# EasyEDA Pro project ProPrj_Pico_Pi_W_2024-12-25.epro

# Schematic PicoW
Board Name: PIcoBatt_R001; Create Date: 2024-12-15; Page Name: MAIN; Project Name: Pico_Pi_W; Schematic Name: PicoW; Update Date: 2024-12-24; Company: EasyEDA.com; Page Size: A4; Version: V1.0
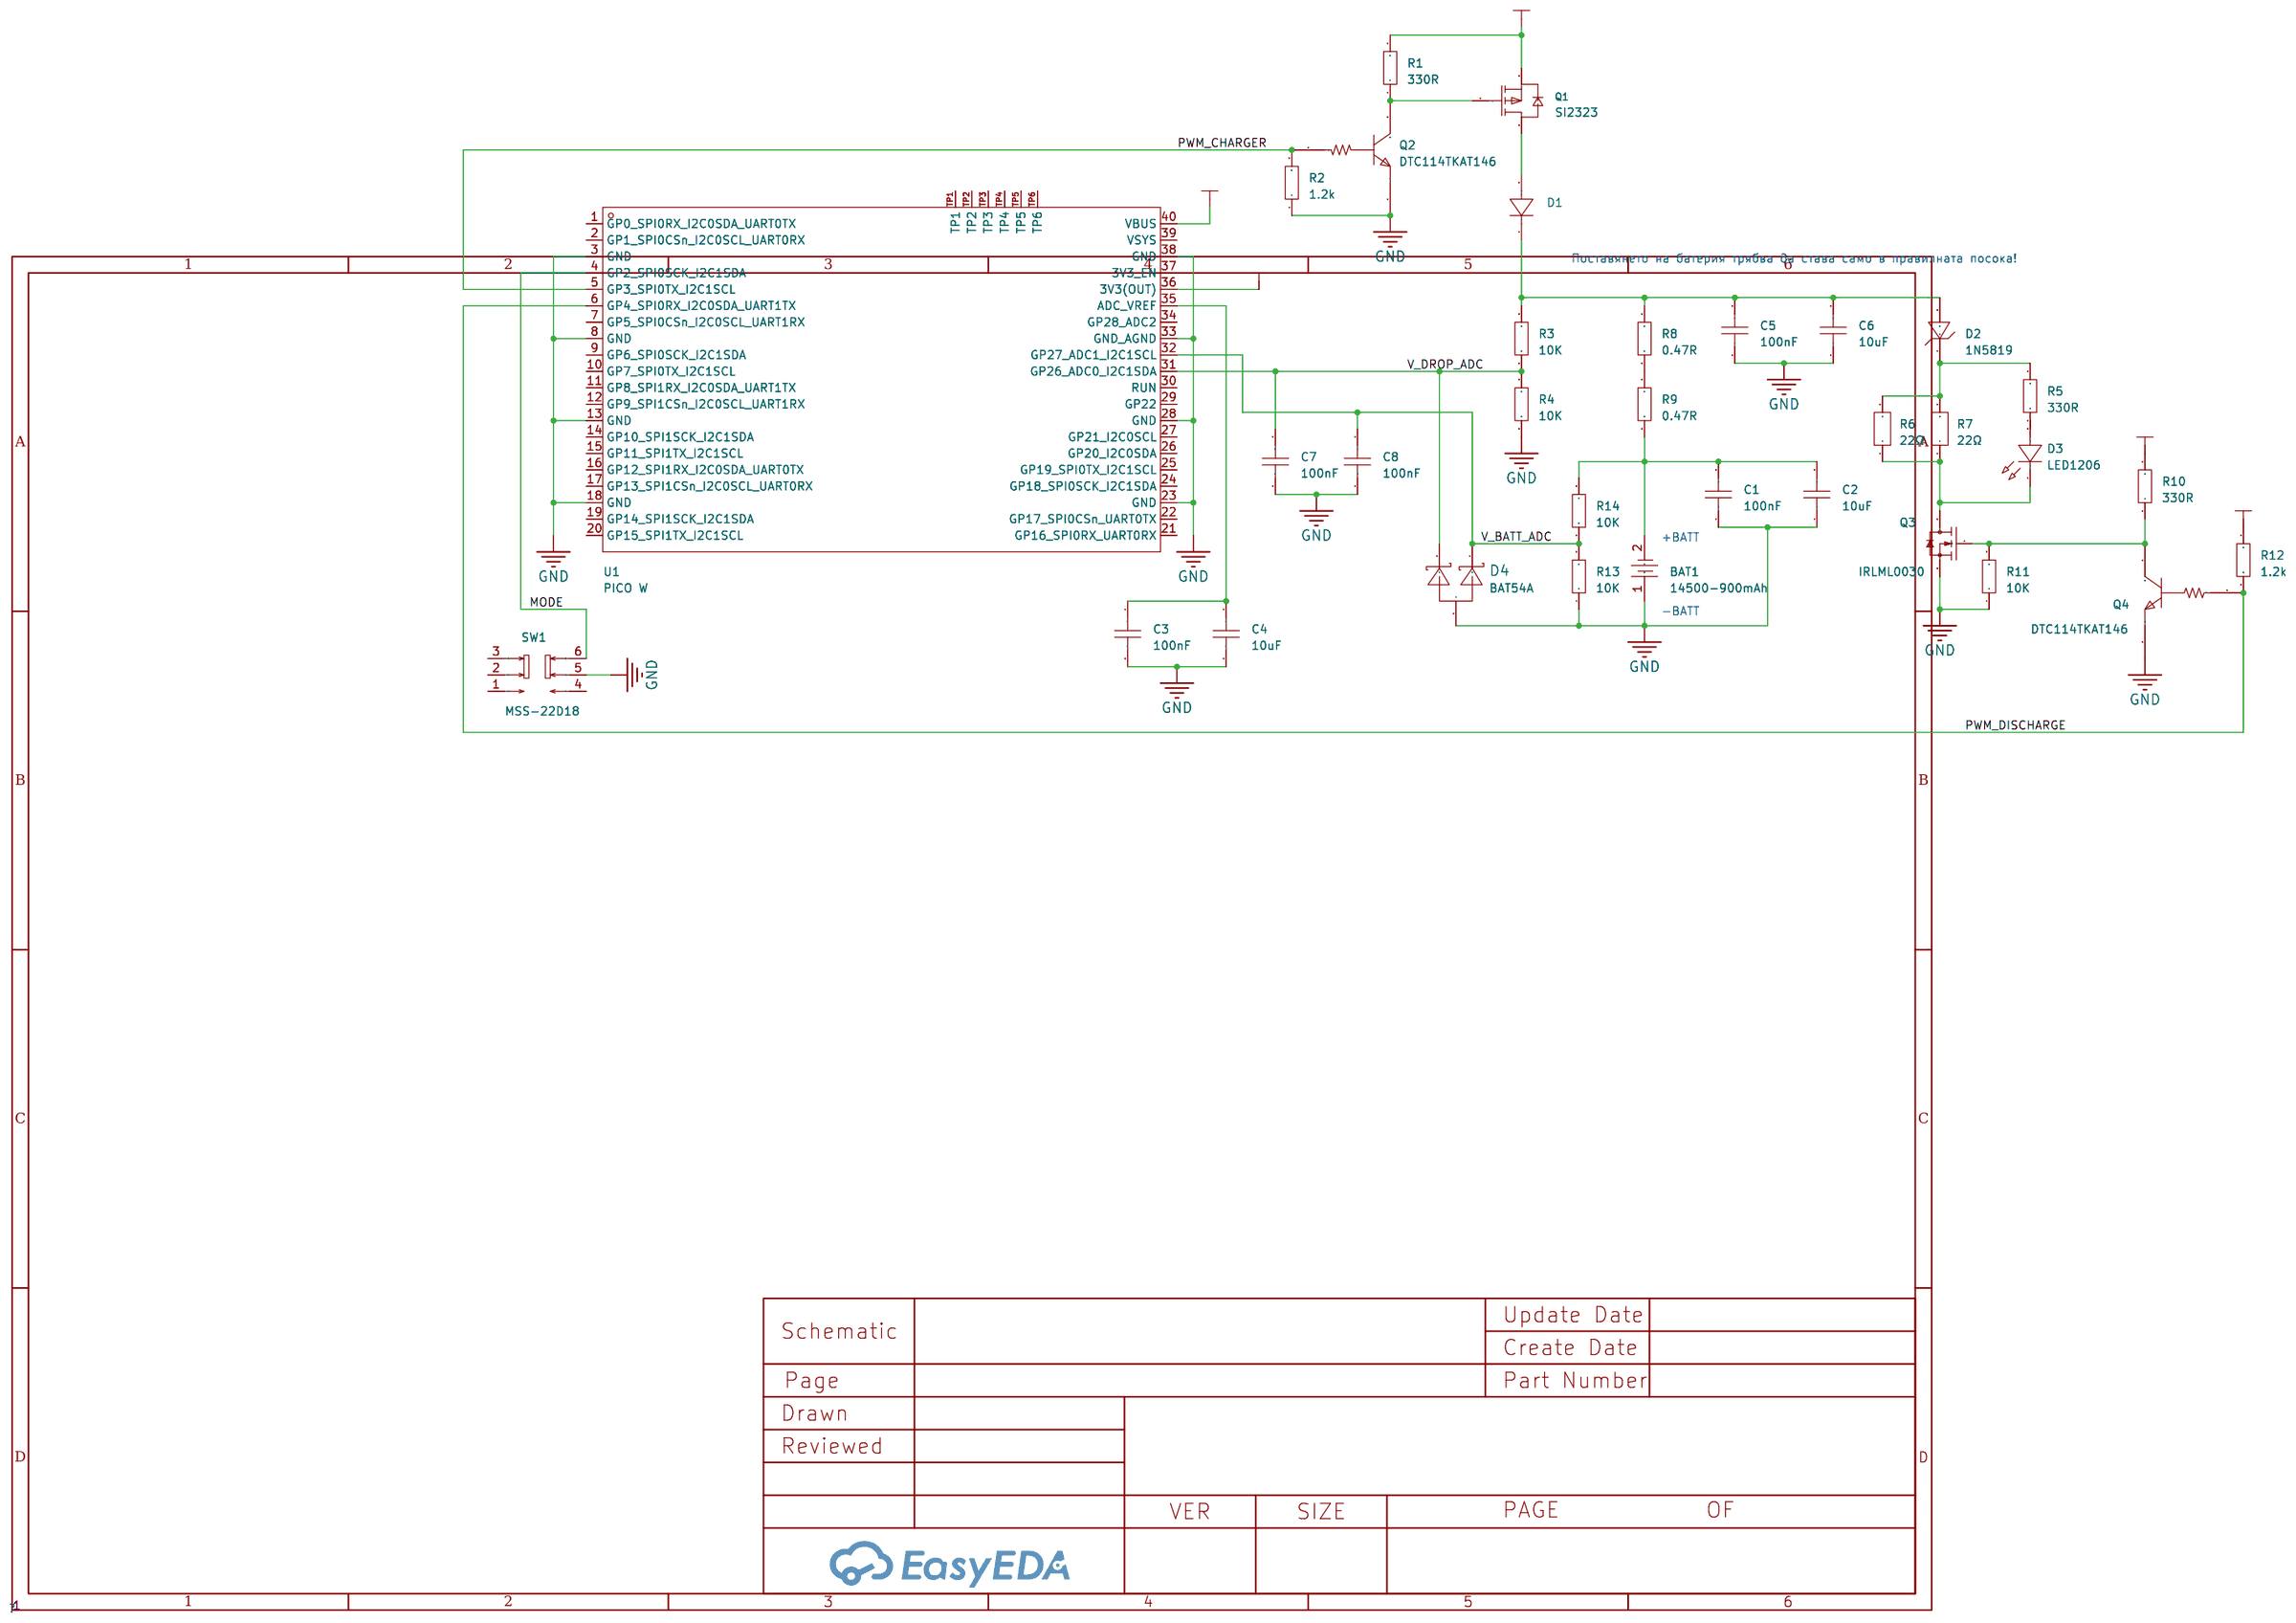
[diagram p0: schematic sheet]

## Parts
BAT1  14500-900mAh  [BAT-TH_FLY-ER14250-1200MAH-01]
C1  100nF  [C0805]
C2  10uF  [C0805]
C3  100nF  [C0805]
C4  10uF  [C0805]
C5  100nF  [C0805]
C6  10uF  [C0805]
C7  100nF  [C0805]
C8  100nF  [C0805]
D1  -  [SMA_L4.4-W2.8-LS5.4-RD]
D2  1N5819  [DO-41_BD2.4-L4.7-P8.70-D0.9-RD]
D3  LED1206  [LED1206-RD]
D4  BAT54A  [SOT-23-3_L2.9-W1.3-P1.90-LS2.4-BR]
Q1  SI2323  [SOT-23-3_L2.9-W1.3-P0.95-LS2.4-BR]
Q2  DTC114TKAT146  [SOT-346_L2.9-W1.6-P1.90-LS2.8-TR-CW]
Q3  IRLML0030  [SOT-23-3_L2.9-W1.3-P1.90-LS2.4-BR]
Q4  DTC114TKAT146  [SOT-346_L2.9-W1.6-P1.90-LS2.8-TR-CW]
R1  330R  [R0603]
R2  1.2k  [R0603]
R3  10K  [R0603]
R4  10K  [R0603]
R5  330R  [R0603]
R6  22Ω  [RES-TH_BD8.5-L24.5-P28.5-D0.7]
R7  22Ω  [RES-TH_BD8.5-L24.5-P28.5-D0.7]
R8  0.47R  [R0603]
R9  0.47R  [R0603]
R10  330R  [R0603]
R11  10K  [R0603]
R12  1.2k  [R0603]
R13  10K  [R0603]
R14  10K  [R0603]
SW1  MSS-22D18  [SW-TH_MSS-22D18]
U1  PICO W  [COMM-SMD_L51.0-W21.0-P2.54_PICOW]

## Library data of the parts
BAT1 = FLY-ER14250-1200mAh-01: LCSC Part Name: FLYOUNG(远阳) 锂亚电池 3.6V 1200mAh 1个; Supplier Part: C5452119; Manufacturer: FLYOUNG(远阳); Datasheet: https://atta.szlcsc.com/upload/public/pdf/source/20230427/35F5717F1146E75F362941FF46E4B7A2.pdf; Supplier: LCSC
C1-C8 = CAP_0805: Supplier Footprint: 0805
D1 = 1N4007: Supplier Footprint: SMA(DO-214AC); Supplier Part: C727081
D2 = 1N5819_C393567: Forward Voltage (Vf@If):600mV@1A Reverse Voltage (Vr):40V Average Rectified Current (Io):1A; LCSC Part Name: 电压:40V 电流:1A; Supplier Part: C393567; Manufacturer: 银河微电子; Supplier Footprint: DO-41; JLCPCB Part Class: Extended Part; Datasheet: https://atta.szlcsc.com/upload/public/pdf/source/20190516/C393567_30CB360D1A9B1F2C106DA119C236D680.pdf; Supplier: LCSC; Forward Voltage (Vf@If): 600mV@1A; Reverse Voltage (Vr): 40V; Average Rectified Current (Io): 1A
D3 = LED1206: Supplier Part: C9900027223; Supplier: LCSC
D4 = BAT54A: Forward Voltage (Vf@If):800mV@100mA Reverse Voltage (Vr):30V Average Rectified Current (Io):200mA; LCSC Part Name: 电压:30V 电流:200mA; Supplier Part: C179724; Manufacturer: HT(金誉); Supplier Footprint: SOT-23; Datasheet: https://atta.szlcsc.com/upload/public/pdf/source/20180207/C179724_15179896975631356395.pdf; Supplier: LCSC; Forward Voltage (Vf@If): 800mV@100mA; Reverse Voltage (Vr): 30V; Average Rectified Current (Io): 200mA
Q1 = SI2323: Type:1 Piece P-Channel Drain Source Voltage (Vdss):20V Continuous Drain Current (Id): Drain Source On Resistance (RDS(on)@Vgs,Id):50mΩ@2.5V Power Dissipation (Pd): Gate Threshold Voltage (Vgs(th)@Id):600mV@250uA Total Gate Charge (Qg@Vgs):8.5nC Input Capa; LCSC Part Name: P沟道,电流:5.3A,耐压:20V; Supplier Part: C5278892; Manufacturer: PAKER(派克微); Supplier Footprint: SOT-23; JLCPCB Part Class: Extended Part; Datasheet: https://atta.szlcsc.com/upload/public/pdf/source/20240104/3F2180898E74DA13754BF2A6B06D0427.pdf; Supplier: LCSC; Type: 1 Piece P-Channel; Drain Source Voltage (Vdss): 20V; Drain Source On Resistance (RDS(on)@Vgs,Id): 50mΩ@2.5V; Gate Threshold Voltage (Vgs(th)@Id): 600mV@250uA; Total Gate Charge (Qg@Vgs): 8.5nC; Input Capacitance (Ciss@Vds): 830pF; Reverse Transfer Capacitance (Crss@Vds): 85pF; Operating Temperature: -55℃~+150℃
Q2 Q4 = DTC114TKAT146: Transistor Type:- Collector-Emitter Breakdown Voltage (Vceo):50V Collector Current (Ic):100mA Power Dissipation (Pd):200mW DC Current Gain (hFE@Ic,Vce):100@1mA,5V Input Resistor:10kΩ Operating Temperature:-55℃~+150℃ Operating Temperature:-55℃~+150℃; LCSC Part Name: 耐压:50V 电流:100mA; Supplier Part: C111720; Manufacturer: ROHM(罗姆); Supplier Footprint: TO-236-3(SOT-23-3); JLCPCB Part Class: Extended Part; Datasheet: https://atta.szlcsc.com/upload/public/pdf/source/20170726/C111720_1501054455780843917.pdf; Supplier: LCSC; Collector-Emitter Breakdown Voltage (Vceo): 50V; Collector Current (Ic): 100mA; Power Dissipation (Pd): 200mW; DC Current Gain (hFE@Ic,Vce): 100@1mA,5V; Input Resistor: 10kΩ; Operating Temperature: -55℃~+150℃
Q3 = IRLML0030: Drain Source Voltage (Vdss): Continuous Drain Current (Id): Drain Source On Resistance (RDS(on)@Vgs,Id):38mΩ@10V Power Dissipation (Pd): Gate Threshold Voltage (Vgs(th)@Id):1.5V@250uA Total Gate Charge (Qg@Vgs):3nC@10V Input Capacitance (Ciss@Vds):233pF@1; LCSC Part Name: N沟道增强型MOSFET,电流:4.2A,耐压:30V; Supplier Part: C3647050; Manufacturer: Leiditech(雷卯电子); Supplier Footprint: SOT-23; JLCPCB Part Class: Extended Part; Datasheet: https://atta.szlcsc.com/upload/public/pdf/source/20220704/5B0D23EAE294CB70633FB1104757A67C.pdf; Supplier: LCSC; Drain Source On Resistance (RDS(on)@Vgs,Id): 38mΩ@10V; Gate Threshold Voltage (Vgs(th)@Id): 1.5V@250uA; Total Gate Charge (Qg@Vgs): 3nC@10V; Input Capacitance (Ciss@Vds): 233pF@15V; Reverse Transfer Capacitance (Crss@Vds): 33pF@15V; Operating Temperature: -55℃~+150℃
R1-R5 R8-R14 = Res_0603: Supplier Footprint: 0603
R6 R7 = FKN500JR-91-15R: Type:Wirewound Resistors Resistance: Tolerance:±5% Tolerance:±5% Power(Watts):5W Temperature Coefficient:- Temperature Coefficient:- Operating Temperature Range:-40℃~+155℃ Operating Temperature Range:-40℃~+155℃; LCSC Part Name: 绕线电阻 15Ω ±5% 5W; Supplier Part: C1780833; Manufacturer: YAGEO(国巨); Supplier Footprint: 插件,D8xL24.5mm; JLCPCB Part Class: Extended Part; Datasheet: https://atta.szlcsc.com/upload/public/pdf/source/20210425/7580E5AA8412315F16E935FDD29973CE.pdf; Supplier: LCSC; Type: Wirewound Resistors; Tolerance: ±5%; Power(Watts): 5W; Operating Temperature Range: -40℃~+155℃
SW1 = MSS-22D18(杆长2mm): Supplier Part: C9900004549; Supplier Footprint: 插件; Supplier: LCSC
U1 = PICO W: Supplier Part: C7203003; Manufacturer: Raspberry Pi(树莓派); JLCPCB Part Class: Extended Part; Datasheet: https://atta.szlcsc.com/upload/public/pdf/source/20230906/10B4C0665D815973E97A5F4971CA719F.pdf; Supplier: LCSC

## Nets
+3V: R12.2 U1.36(3V3(OUT))
+5V: Q1.2(S) R1.2 R10.2 U1.40(VBUS)
GND: BAT1.1 C1.1 C2.1 C3.2 C4.2 C5.1 C6.1 C7.1 C8.1 D4.3(K) Q2.1(E) Q3.2(S) Q4.1(E) R2.1 R4.1 R11.1 R13.1 SW1.5 U1.3(GND) U1.8(GND) U1.13(GND) U1.18(GND) U1.23(GND) U1.28(GND) U1.33(GND_AGND) U1.38(GND)
MODE: SW1.6 U1.4(GP2_SPI0SCK_I2C1SDA)
PWM_CHARGER: Q2.2(B) R2.2 U1.5(GP3_SPI0TX_I2C1SCL)
PWM_DISCHARGE: Q4.2(B) R12.1 U1.6(GP4_SPI0RX_I2C0SDA_UART1TX)
V_BATT_ADC: C8.2 D4.1(A) R13.2 R14.1 U1.32(GP27_ADC1_I2C1SCL)
V_DROP_ADC: C7.2 D4.2(A) R3.1 R4.2 U1.31(GP26_ADC0_I2C1SDA)
Net-(BAT1-2): BAT1.2 C1.2 C2.2 R9.1 R14.2
Net-(C3-1): C3.1 C4.1 U1.35(ADC_VREF)
Net-(C5-2): C5.2 C6.2 D1.1(K) D2.2(A) R3.2 R8.1
Net-(D1-2): D1.2(A) Q1.3(D)
Net-(D2-1): D2.1(C) R5.2 R6.2 R7.2
Net-(D3-1): D3.1(K) Q3.3(D) R6.1 R7.1
Net-(D3-2): D3.2(A) R5.1
Net-(Q1-1): Q1.1(G) Q2.3(C) R1.1
Net-(Q3-1): Q3.1(G) Q4.3(C) R10.1 R11.2
Net-(R8-2): R8.2 R9.2

Not connected (* = marked no-connect by the designer): SW1 1 2 3 4; U1 1(GP0_SPI0RX_I2C0SDA_UART0TX) 2(GP1_SPI0CSn_I2C0SCL_UART0RX) 7(GP5_SPI0CSn_I2C0SCL_UART1RX) 9(GP6_SPI0SCK_I2C1SDA) 10(GP7_SPI0TX_I2C1SCL) 11(GP8_SPI1RX_I2C0SDA_UART1TX) 12(GP9_SPI1CSn_I2C0SCL_UART1RX) 14(GP10_SPI1SCK_I2C1SDA) 15(GP11_SPI1TX_I2C1SCL) 16(GP12_SPI1RX_I2C0SDA_UART0TX) 17(GP13_SPI1CSn_I2C0SCL_UART0RX) 19(GP14_SPI1SCK_I2C1SDA) 20(GP15_SPI1TX_I2C1SCL) 21(GP16_SPI0RX_UART0RX) 22(GP17_SPI0CSn_UART0TX) 24(GP18_SPI0SCK_I2C1SDA) 25(GP19_SPI0TX_I2C1SCL) 26(GP20_I2C0SDA) 27(GP21_I2C0SCL) 29(GP22) 30(RUN) 34(GP28_ADC2) 37(3V3_EN) 39(VSYS) TP1 TP2 TP3 TP4 TP5 TP6

## Notes on the sheet
- Поставянето на батерия трябва да става само в правилната посока!
- +BATT
- -BATT
